# EAGLE design skema (EAGLE 6.4)
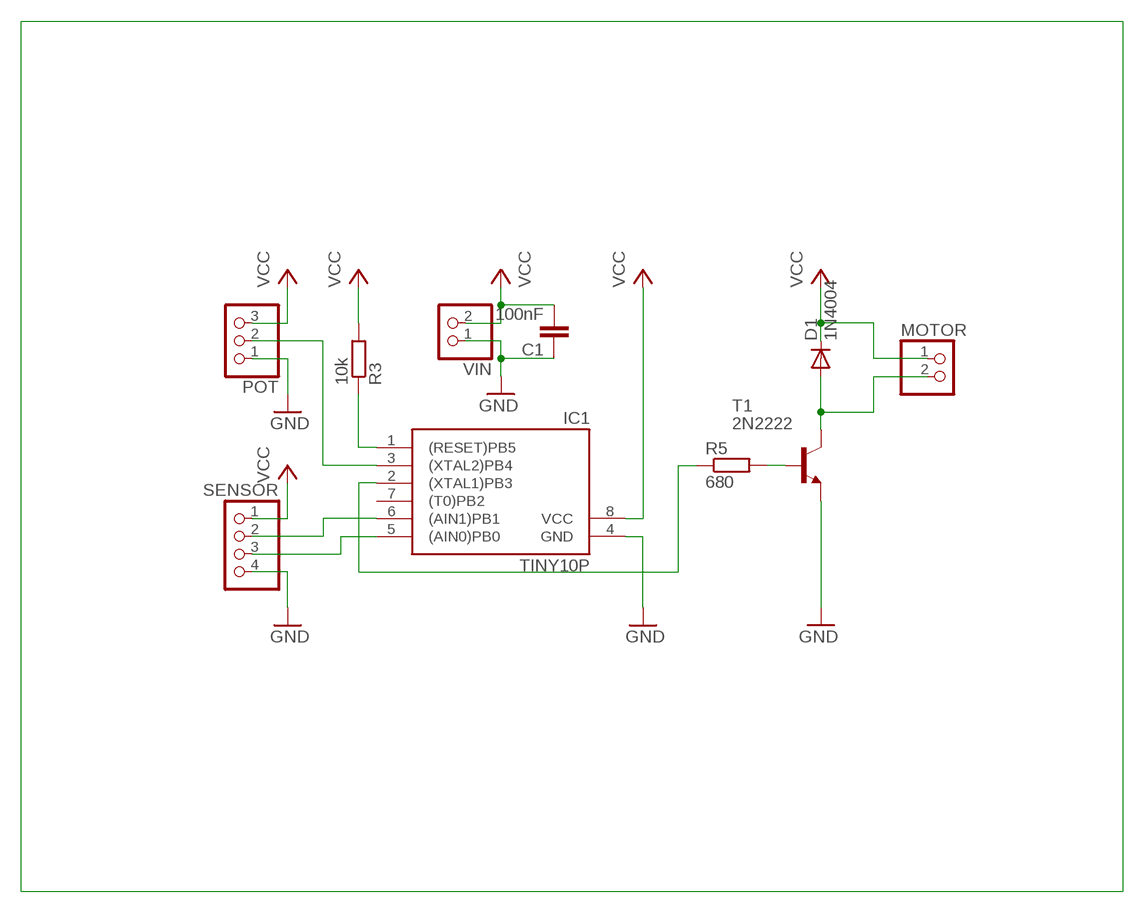
[diagram p0: schematic, sheet 1]

## Parts
C1  100nF  C-EU050-025X075  [C050-025X075]
D1  1N4004  [DO41-10]
IC1  TINY10P  [DIL08]
MOTOR  PINHD-1X2  [1X02]
POT  PINHD-1X3  [1X03]
R3  10k  R-EU_0207/10  [0207/10]
R5  680  R-EU_0207/10  [0207/10]
SENSOR  PINHD-1X4  [1X04]
T1  2N2222  [TO18]
VIN  PINHD-1X2  [1X02]

## Nets
GND: C1.1 IC1.4(GND) POT.1 SENSOR.4 T1.1(E) VIN.1
N$1: IC1.3((XTAL2)PB4) POT.2
N$2: IC1.6((AIN1)PB1) SENSOR.2
N$3: IC1.5((AIN0)PB0) SENSOR.3
N$6: R5.2 T1.2(B)
N$7: IC1.1((RESET)PB5) R3.1
N$9: D1.A MOTOR.2 T1.3(C)
N$12: IC1.2((XTAL1)PB3) R5.1
VCC: C1.2 D1.C IC1.8(VCC) MOTOR.1 POT.3 R3.2 SENSOR.1 VIN.2
Unconnected: IC1.7((T0)PB2)

## Library data of the parts
C1 = rcl:C-EU: CAPACITOR, European symbol
D1 = diode:1N4004: DIODE general purpose rectifier, 1 A
IC1 = atmel:TINY10: MICROCONTROLLER 1 Kbytes ROM; OC_FARNELL: unknown; OC_NEWARK: unknown
MOTOR VIN = pinhead:PINHD-1X2: PIN HEADER
POT = pinhead:PINHD-1X3: PIN HEADER
R3 R5 = rcl:R-EU_: RESISTOR, European symbol
SENSOR = pinhead:PINHD-1X4: PIN HEADER
T1 = transistor:2N2222: NPN TRANSISTOR

## Board
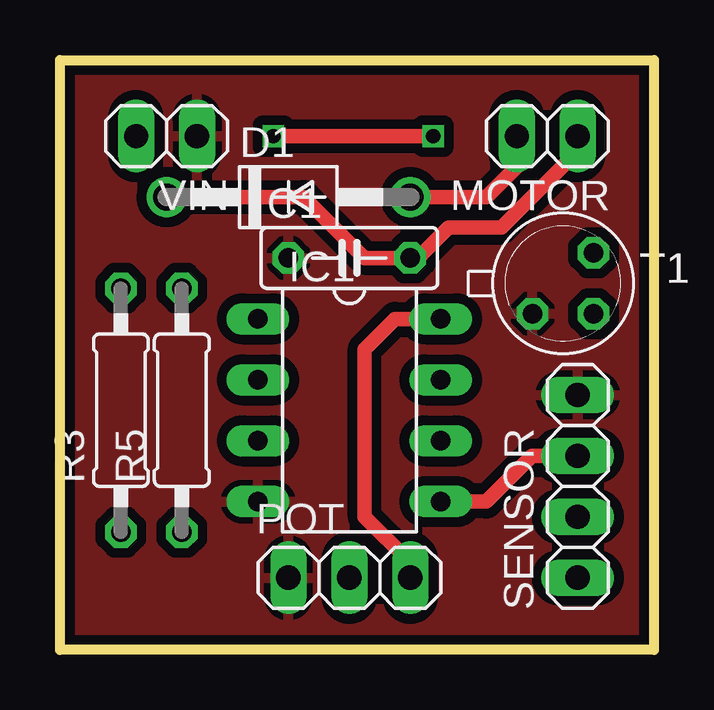
[diagram p1: board, top side]
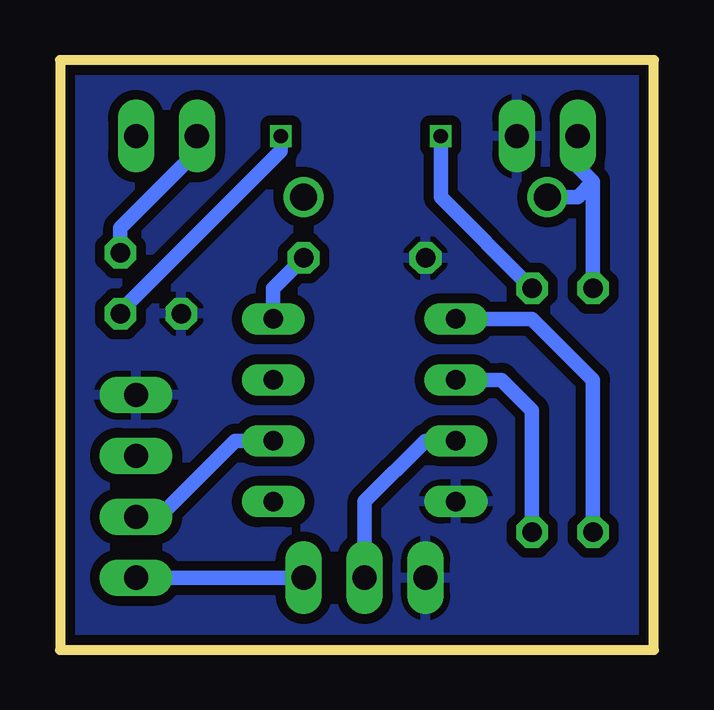
[diagram p2: board, bottom side, seen from below]

Size 24.77 x 24.6 mm. Coordinates in mm from the lower left corner, seen from the top.
Outline: 0,0 0,24.6 24.77,24.6 24.77,0 0,0
Copper layers (1*16): Top 0.035mm / dielectric 1.5mm / Bottom 0.035mm
Design rules "dirt_cheap_dirty_boards.v1": minimum track width 5mil, minimum drill 12mil, track to track 5mil, track to pad 5mil, pad to pad 5mil, via to via 5mil, smd to smd 0mil, copper to edge 10mil, drill to drill 10mil, minimum pad ring 10mil, minimum via ring 6mil, stop-mask expansion 2mil, vias tented up to drill 25mil, thermal gap 10mil

### Footprints (pad centres in the part's own frame; a part is rotated, then mirrored left to right if it is on the bottom)
C050-025X075 = drill 0.813 octagon: 1 -2.54,0; 2 2.54,0
DO41-10 = drill 1.118: A 5.08,0; C -5.08,0
DIL08 = drill 0.813 long: 1 -3.81,-3.81; 2 -1.27,-3.81; 3 1.27,-3.81; 4 3.81,-3.81; 5 3.81,3.81; 6 1.27,3.81; 7 -1.27,3.81; 8 -3.81,3.81
1X02 = drill 1.016 long: 1 -1.27,0; 2 1.27,0
1X03 = drill 1.016 long: 1 -2.54,0; 2 0,0; 3 2.54,0
0207/10 = drill 0.813 octagon: 1 -5.08,0; 2 5.08,0
1X04 = drill 1.016 long: 1 -3.81,0; 2 -1.27,0; 3 1.27,0; 4 3.81,0
TO18 = drill 0.813 octagon: 1 -1.27,-1.27; 2 1.27,-1.27; 3 1.27,1.27

### Placement (x,y rotation side)
C1  12.06,16.35 0 top
D1  9.53,18.89 0 top
IC1  12.06,10 270 top
MOTOR  20.32,21.43 180 top
POT  12.06,3.01 0 top
R3  2.54,10 90 top
R5  5.08,10 90 top
SENSOR  21.59,6.82 90 top
T1  20.98,15.29 0 top
VIN  4.45,21.43 180 top

### Tracks (layer width: path | path; a pad name or v marks a point on that pad's centre or on a via)
GND
  pour Bottom (isolate 0.406): -0.15,0.15 0,24.6 24.77,24.6 24.62,0.15
  pour Top (isolate 0.406): 0,0.16 0,24.6 24.77,24.6 24.77,0.16
N$1
  Bottom 0.61: POT.2 12.06,6.19 9.53,8.73 IC1.3
N$2
  Bottom 0.61: SENSOR.2 20.64,5.55 17.46,8.73 IC1.6
N$3
  Top 0.61: SENSOR.3 19.68,8.09 17.78,6.19 IC1.5
N$6  (via drill 0.6)
  Top 0.61: v8.89,21.43 v15.56,21.43
  Bottom 0.61: R5.2 8.89,18.89 v8.89,21.43 | T1.2 22.25,14.11 15.56,20.79 v15.56,21.43
N$7
  Bottom 0.61: R3.1 2.54,11.27 5.08,13.81 IC1.1
N$9
  Top 0.61: D1.A 17.78,18.89 19.05,20.16 MOTOR.2
  Bottom 0.61: 19.05,20.48 19.05,20.79 | 19.05,20.79 MOTOR.2 | T1.3 22.25,17.6 19.05,20.79
N$12
  Bottom 0.61: IC1.2 6.35,11.27 5.08,10 R5.1
VCC
  Top 0.61: D1.C 10.16,18.89 12.7,16.35 C1.2 14.92,16.35 16.19,17.62 18.41,17.62 21.59,20.79 MOTOR.1 | POT.3 14.61,3.65 12.7,5.55 12.7,12.54 13.97,13.81 IC1.8
  Bottom 0.61: 2.54,19.52 R3.2 | D1.C 3.17,18.89 2.54,19.52 | IC1.8 15.88,15.08 C1.2 | SENSOR.1 POT.3 | VIN.2 3.17,20.16 2.54,19.52